# Altium schematic sheet Battery charger.SchDoc
size A4; SheetNumber: 3; SheetTotal: 4
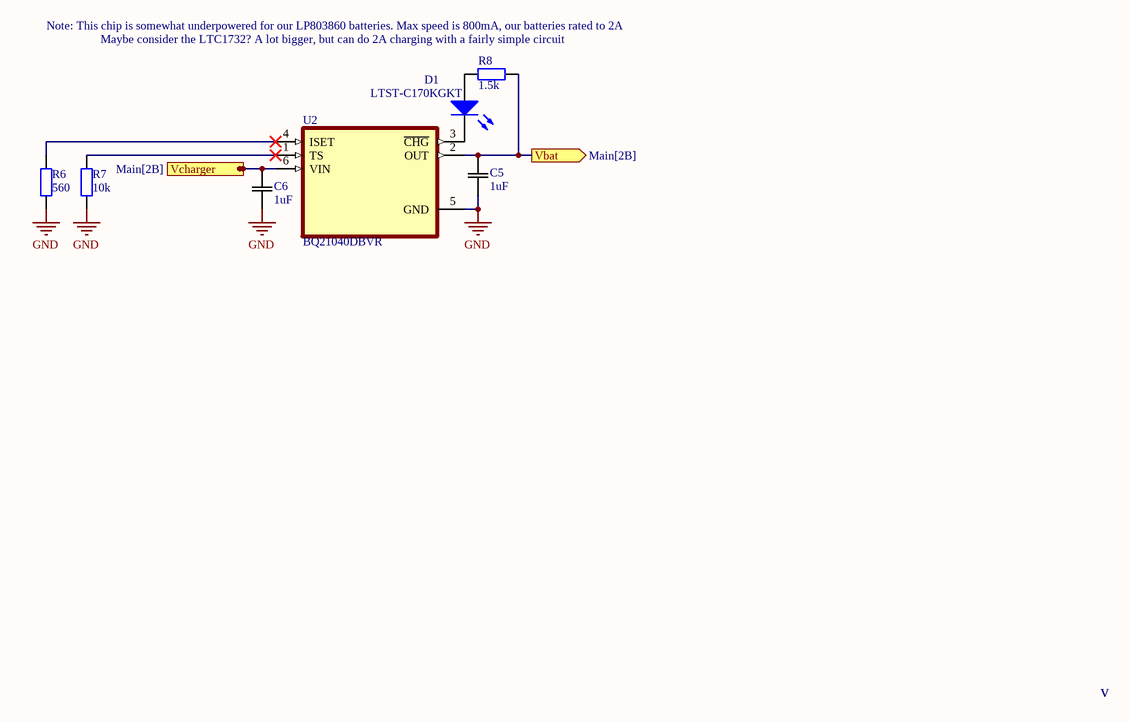
[diagram p0: Battery charger.SchDoc]

## Parts
C5  1uF  [CAPC2012X94N]
C6  1uF  [CAPC2012X94N]
D1  LTST-C170KGKT  [ECE-LED2012-0805SM]
R6  560  [0805]
R7  10k  [0805]
R8  1.5k  [0805]
U2  BQ21040DBVR  [SOT95P280X145-6N]

## Ports
Vbat (out, see Main[2B]), Vcharger (in, see Main[2B])

## Nets
GND: C5.1 C6.1 R6.1 R7.1 U2.5(GND)
Vbat: C5.2 R8.2 U2.2(OUT) ; port Vbat
Vcharger: C6.2 U2.6(VIN) ; port Vcharger
NetD1_1: D1.1(A) R8.1
NetD1_2: D1.2(K) U2.3(~{CHG})
NetR6_2: R6.2 U2.4(ISET)
NetR7_2: R7.2 U2.1(TS)

## Notes on the sheet
- (near R8) Note: This chip is somewhat underpowered for our LP803860 batteries. Max speed is 800mA, our batteries rated to 2A
- (near R8) Maybe consider the LTC1732? A lot bigger, but can do 2A charging with a fairly simple circuit
- v

## Library data of the parts
C5 C6 = CAP 0805: No Description Available; IsInLabBook: Yes; Value: 1uF
D1 = LED
R6-R8 = Res 0805: Resistor; IsInLabBook: Yes
  R6: Value: 560
  R7: Value: 10k
  R8: Value: 1.5k
U2 = BQ21040DBVR: 1-cell, 0.8-A Li-ion and Li-polymer battery charger; MF: Texas Instruments; SnapEDA_Link: https://www.snapeda.com/parts/BQ21040DBVR/Texas+Instruments/view-part/?ref=snap; Package: SOT-23-6 Texas Instruments; MP: BQ21040DBVR; Check_prices: https://www.snapeda.com/parts/BQ21040DBVR/Texas+Instruments/view-part/?ref=eda; Purchase-URL: https://pricing.snapeda.com/search/part/BQ21040DBVR/?ref=eda; Price: None; Value: *; Availability: In Stock